# Altium schematic sheet stm32f103c8t6_basic.SchDoc
size A2; Organization: Altium Limited; Address1: L3, 12a Rodborough Rd; Address2: Frenchs Forest; Address3: NSW; Address4: Australia 2086
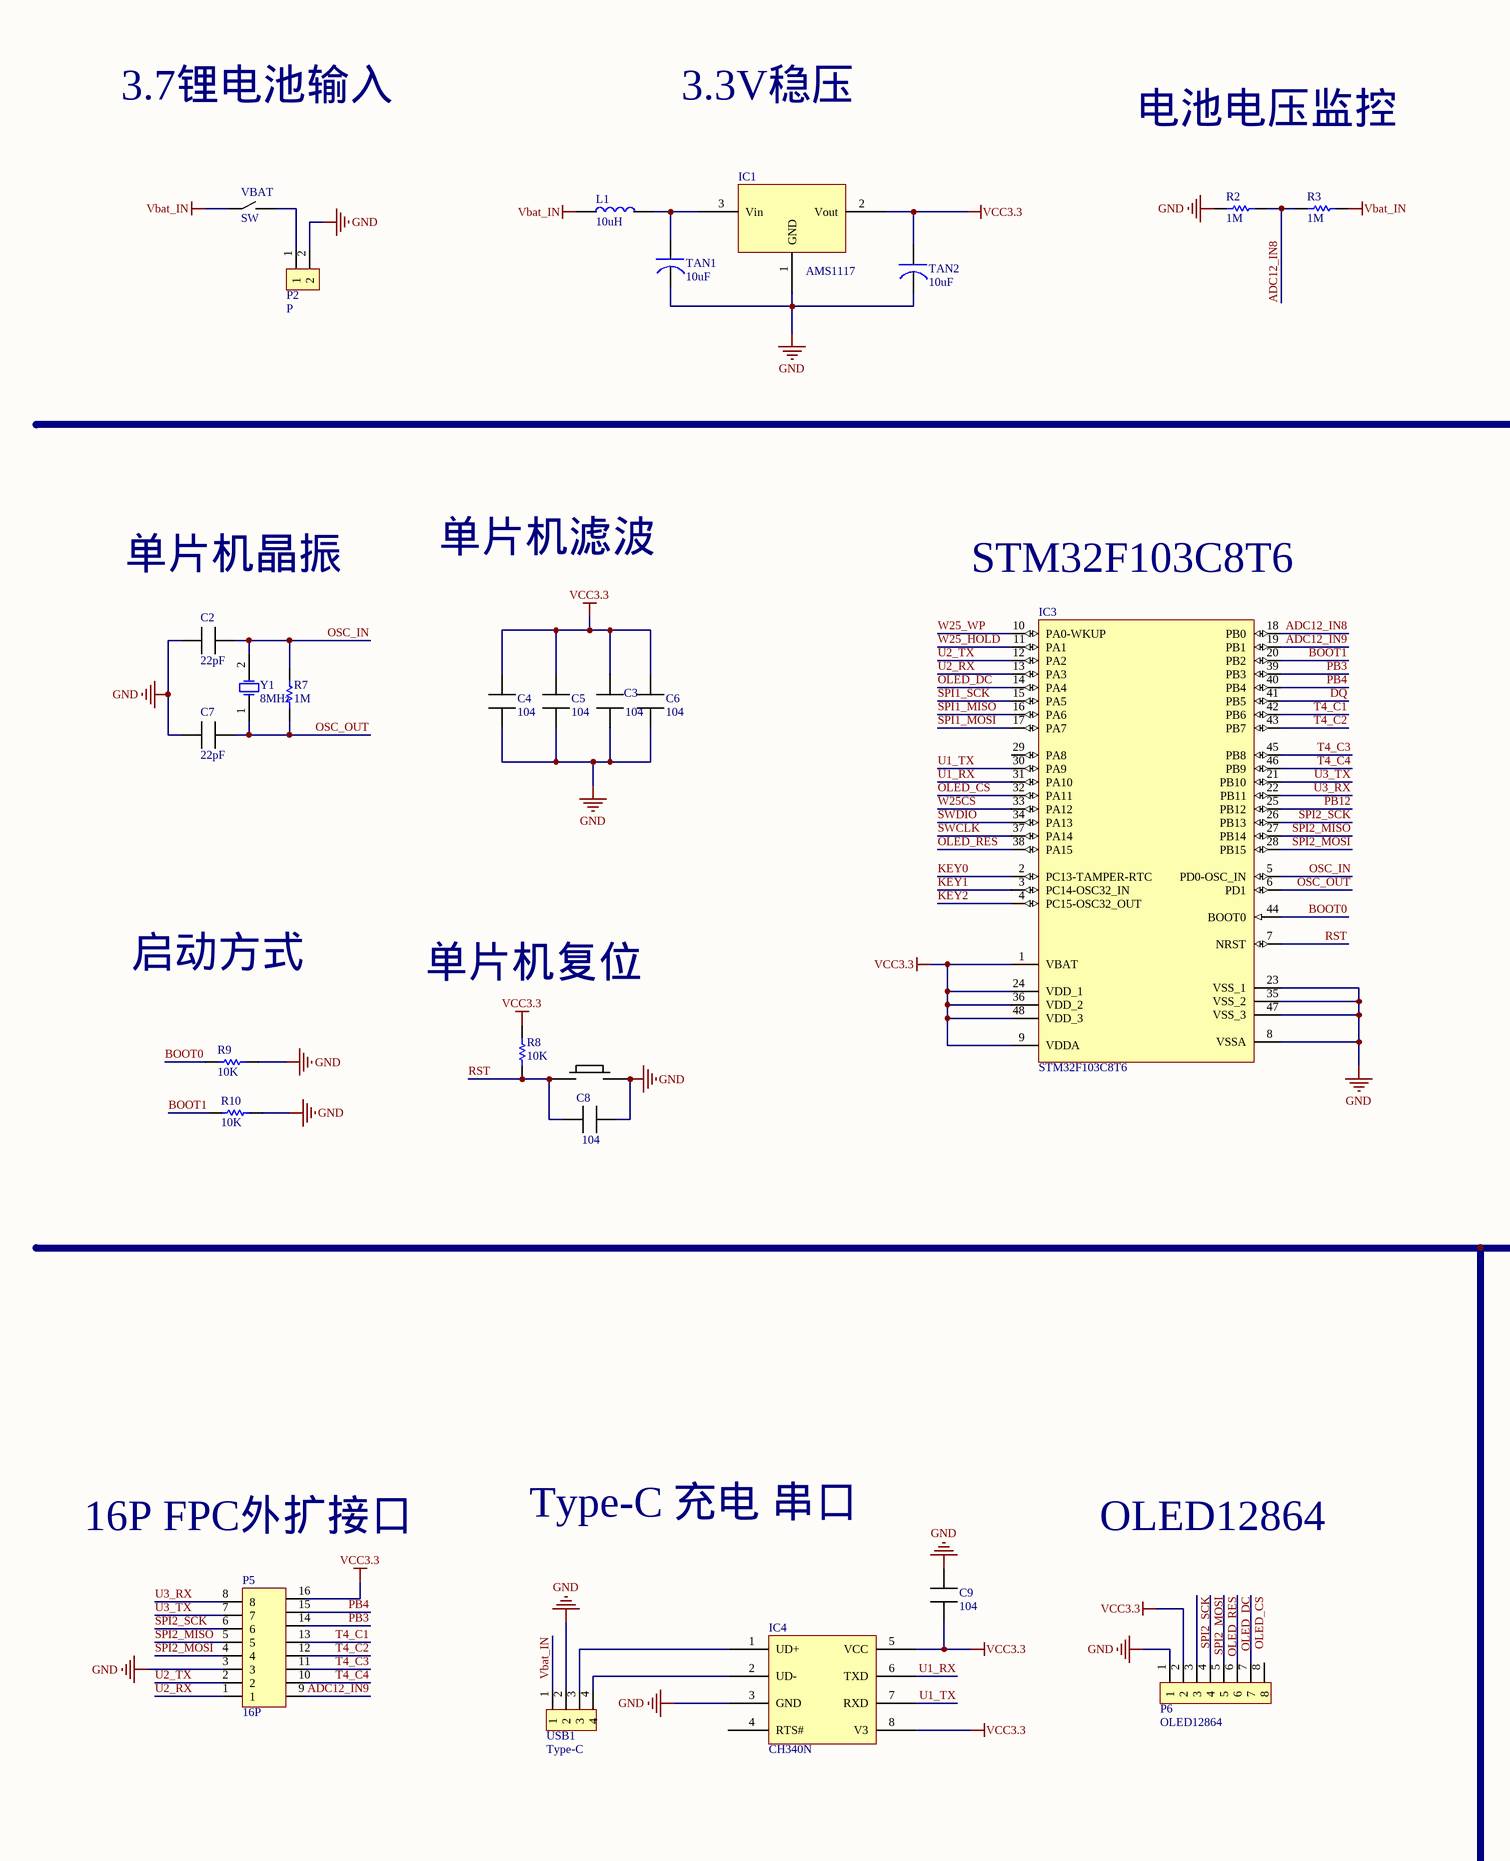
[diagram p0: stm32f103c8t6_basic.SchDoc, left]
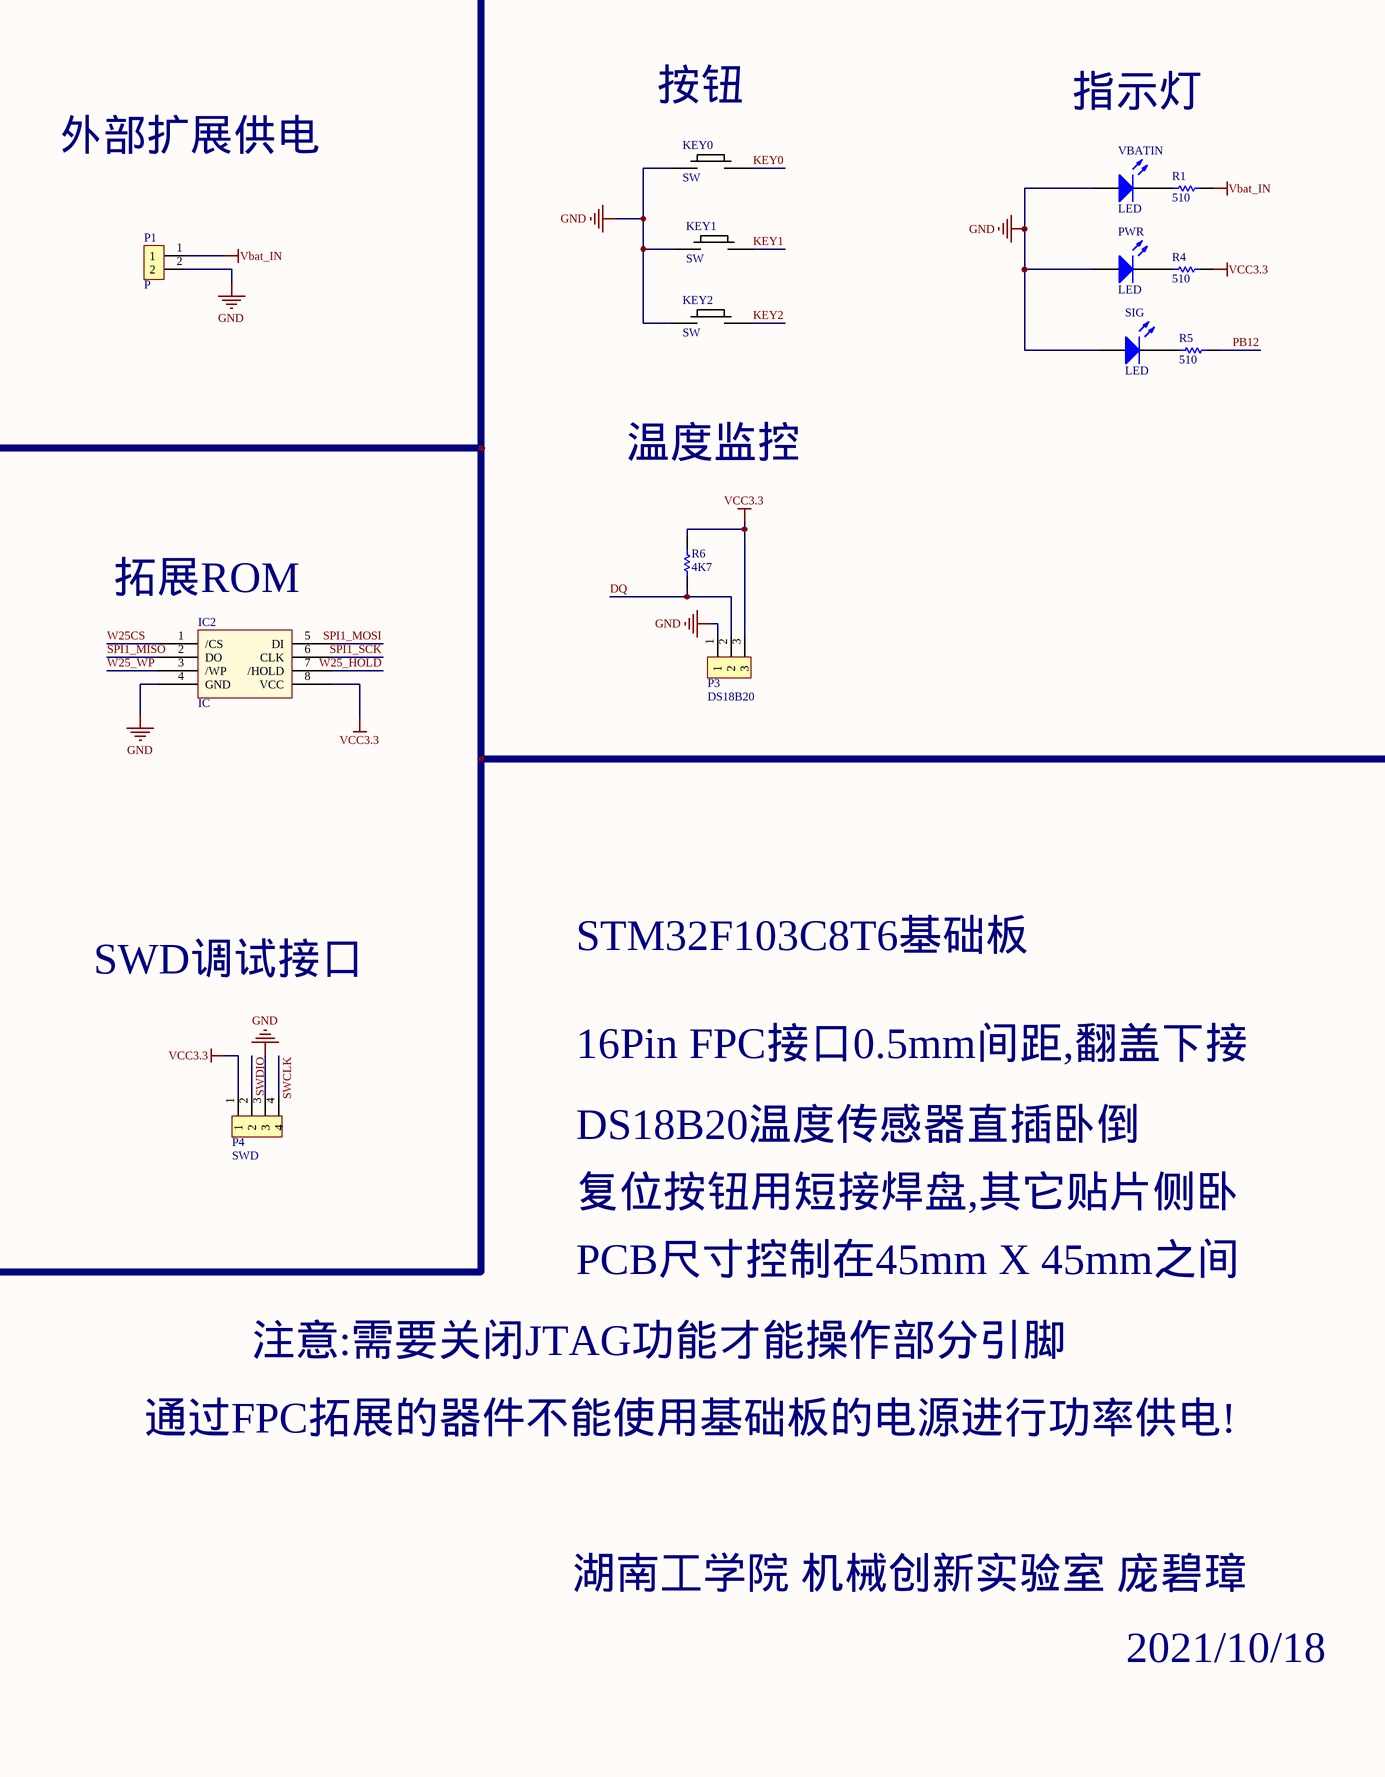
[diagram p1: stm32f103c8t6_basic.SchDoc, right]

## Parts
C2  22pF  [C 0603]
C3  104  [C 0603]
C4  104  [C 0603]
C5  104  [C 0603]
C6  104  [C 0603]
C7  22pF  [C 0603]
C8  104  [C 0603]
C9  104  [C 0603]
IC1  AMS1117  [SOT-223]
IC2  IC  [SOP-8]
IC3  STM32F103C8T6  [LQPF48 7X7]
IC4  CH340N  [SOP-8]
KEY0  SW  [SW SMD 3x6x2.5]
KEY1  SW  [SW SMD 3x6x2.5]
KEY2  SW  [SW SMD 3x6x2.5]
L1  10uH  [L 0603]
P1  P  [HEAD_1X2]
P2  P  [电池焊盘]
P3  DS18B20  [TO92]
P4  SWD  [MX1.25]
P5  16P  [FPC 0.5mm 16P]
P6  OLED12864  [HEAD_1X8]
PWR  LED  [LED 0603]
R1  510  [R 0603]
R2  1M  [R 0603]
R3  1M  [R 0603]
R4  510  [R 0603]
R5  510  [R 0603]
R6  4K7  [R 0603]
R7  1M  [R 0603]
R8  10K  [R 0603]
R9  10K  [R 0603]
R10  10K  [R 0603]
RST  SW  [SW SMD 3x6x2.5]  (value not drawn)
SIG  LED  [LED 0603]
TAN1  10uF  [TAN 0805]
TAN2  10uF  [TAN 0805]
USB1  Type-C  [USB Type-C]
VBAT  SW  [拨动开关 9X3.5X3.5 侧卧]
VBATIN  LED  [LED 0603]
Y1  8MHz  [OSC SMD]

## Nets
GND: C2.1 C3.1 C4.1 C5.1 C6.1 C7.1 C8.2 C9.2 IC1.1(GND) IC2.4(GND) IC3.8(VSSA) IC3.23(VSS_1) IC3.35(VSS_2) IC3.47(VSS_3) IC4.3(GND) KEY0.1 KEY1.1 KEY2.1 P1.2 P2.2 P3.1 P4.3 P5.3 P6.1 PWR.1(A) R2.2 R9.1 R10.1 RST.2 SIG.1(A) TAN1.1 TAN2.1 USB1.2 VBATIN.1(A)
Vbat_IN: L1.1 P1.1 R1.1 R3.1 USB1.1 VBAT.2
VCC3.3: C3.2 C4.2 C5.2 C6.2 C9.1 IC1.2(Vout) IC2.8(VCC) IC3.1(VBAT) IC3.9(VDDA) IC3.24(VDD_1) IC3.36(VDD_2) IC3.48(VDD_3) IC4.5(VCC) IC4.8(V3) P3.3 P4.1 P5.16 P6.2 R4.1 R6.1 R8.2 TAN2.2
ADC12_IN8: IC3.18(PB0) R2.1 R3.2
ADC12_IN9: IC3.19(PB1) P5.9
BOOT0: IC3.44(BOOT0) R9.2
BOOT1: IC3.20(PB2) R10.2
DQ: IC3.41(PB5) P3.2 R6.2
KEY0: IC3.2(PC13-TAMPER-RTC) KEY0.2
KEY1: IC3.3(PC14-OSC32_IN) KEY1.2
KEY2: IC3.4(PC15-OSC32_OUT) KEY2.2
OLED_CS: IC3.32(PA11) P6.7
OLED_DC: IC3.14(PA4) P6.6
OLED_RES: IC3.38(PA15) P6.5
OSC_IN: C2.2 IC3.5(PD0-OSC_IN) R7.2 Y1.2(OSC2)
OSC_OUT: C7.2 IC3.6(PD1) R7.1 Y1.1(OSC1)
PB3: IC3.39(PB3) P5.14
PB4: IC3.40(PB4) P5.15
PB12: IC3.25(PB12) R5.1
RST: C8.1 IC3.7(NRST) R8.1 RST.1
SPI1_MISO: IC2.2(DO) IC3.16(PA6)
SPI1_MOSI: IC2.5(DI) IC3.17(PA7)
SPI1_SCK: IC2.6(CLK) IC3.15(PA5)
SPI2_MISO: IC3.27(PB14) P5.5
SPI2_MOSI: IC3.28(PB15) P5.4 P6.4
SPI2_SCK: IC3.26(PB13) P5.6 P6.3
SWCLK: IC3.37(PA14) P4.4
SWDIO: IC3.34(PA13) P4.2
T4_C1: IC3.42(PB6) P5.13
T4_C2: IC3.43(PB7) P5.12
T4_C3: IC3.45(PB8) P5.11
T4_C4: IC3.46(PB9) P5.10
U1_RX: IC3.31(PA10) IC4.6(TXD)
U1_TX: IC3.30(PA9) IC4.7(RXD)
U2_RX: IC3.13(PA3) P5.1
U2_TX: IC3.12(PA2) P5.2
U3_RX: IC3.22(PB11) P5.8
U3_TX: IC3.21(PB10) P5.7
W25_HOLD: IC2.7(/HOLD) IC3.11(PA1)
W25_WP: IC2.3(/WP) IC3.10(PA0-WKUP)
W25CS: IC2.1(/CS) IC3.33(PA12)
NetIC1_3: IC1.3(Vin) L1.2 TAN1.2
NetIC4_1: IC4.1(UD+) USB1.3
NetIC4_2: IC4.2(UD-) USB1.4
NetP2_1: P2.1 VBAT.1
NetPWR_2: PWR.2(K) R4.2
NetR1_2: R1.2 VBATIN.2(K)
NetR5_2: R5.2 SIG.2(K)

Not connected (* = marked no-connect by the designer): IC3 29(PA8); IC4 4(RTS#); P6 8

## Notes on the sheet
- 按钮
- 指示灯
- 3.7锂电池输入
- 3.3V稳压
- 电池电压监控
- 外部扩展供电
- 温度监控
- 单片机晶振
- 单片机滤波
- (near IC2) 拓展ROM
- (near IC3) STM32F103C8T6
- 启动方式
- SWD调试接口
- STM32F103C8T6基础板
- (near R8) 单片机复位
- 16Pin FPC接口0.5mm间距,翻盖下接
- DS18B20温度传感器直插卧倒
- 复位按钮用短接焊盘,其它贴片侧卧
- PCB尺寸控制在45mm X 45mm之间
- 注意:需要关闭JTAG功能才能操作部分引脚
- 通过FPC拓展的器件不能使用基础板的电源进行功率供电!
- 16P FPC外扩接口
- Type-C 充电 串口
- OLED12864
- 湖南工学院 机械创新实验室 庞碧璋
- 2021/10/18
- Title
- Size:
- Date:
- File:
- A2
- Number:
- Time:
- Revision:
- Sheet
- of

## Library data of the parts
C2-C9 = 电容
IC1 = AMS1117-3.3
IC2 = w25q16
KEY0-KEY2 RST = 弹簧开关
L1 = 电感
P1 P2 = 1X2排针
P3 = 1X3排针
P4 = 1X4排针
P6 = 1X8排针
PWR SIG VBATIN = LED: Typical INFRARED GaAs LED; Published: 8-Jun-2000; LatestRevisionDate: 08-Jul-2005; LatestRevisionNote: Mech Layer 1 removed.; PackageReference: LED-0; Publisher: Altium Limited; PackageDescription: LED; 2 Leads
R1-R10 = Res: Resistor; Published: 8-Jun-2000; LatestRevisionDate: 17-Jul-2002; LatestRevisionNote: Re-released for DXP Platform.; PackageReference: AXIAL-0.3; Publisher: Altium Limited; PackageDescription: Axial Device, Thru-Hole; 2 Leads; 0.3 in Pin Spacing
TAN1 TAN2 = 极性电容
USB1 = 1X4排针: pin to pad: 1>B4 2>A12 3>B6 4>B7
VBAT = 开关
Y1 = 晶振: Crystal Oscillator; Published: 8-Jun-2000; LatestRevisionDate: 17-Jul-2002; LatestRevisionNote: Re-released for DXP Platform.; PackageReference: R38; Publisher: Altium Limited; PackageDescription: Crystal, Thru-Hole; 2 Leads; Body 3.1 x 8.2 mm (Dia.xH)